# Altium schematic sheet Top Level Schematic.SchDoc
size A; SheetNumber: 1; SheetTotal: 1
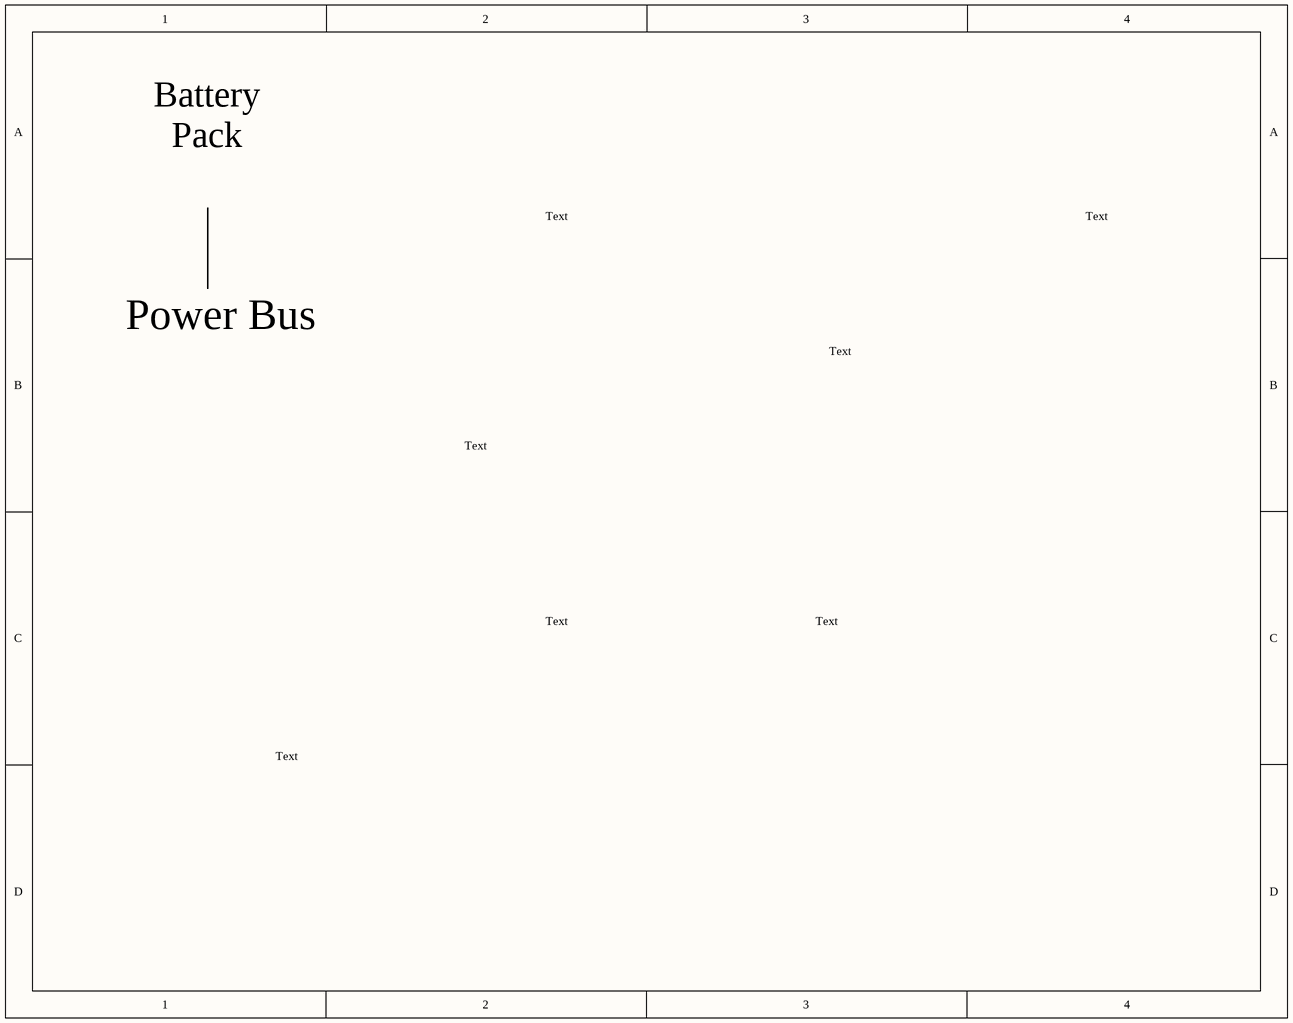
[diagram p0: Top Level Schematic.SchDoc]

## Notes on the sheet
- Battery Pack
- Power Bus
- Text